# Altium schematic sheet FPGA_Power.SchDoc
size B; SheetNumber: 6; SheetTotal: 11
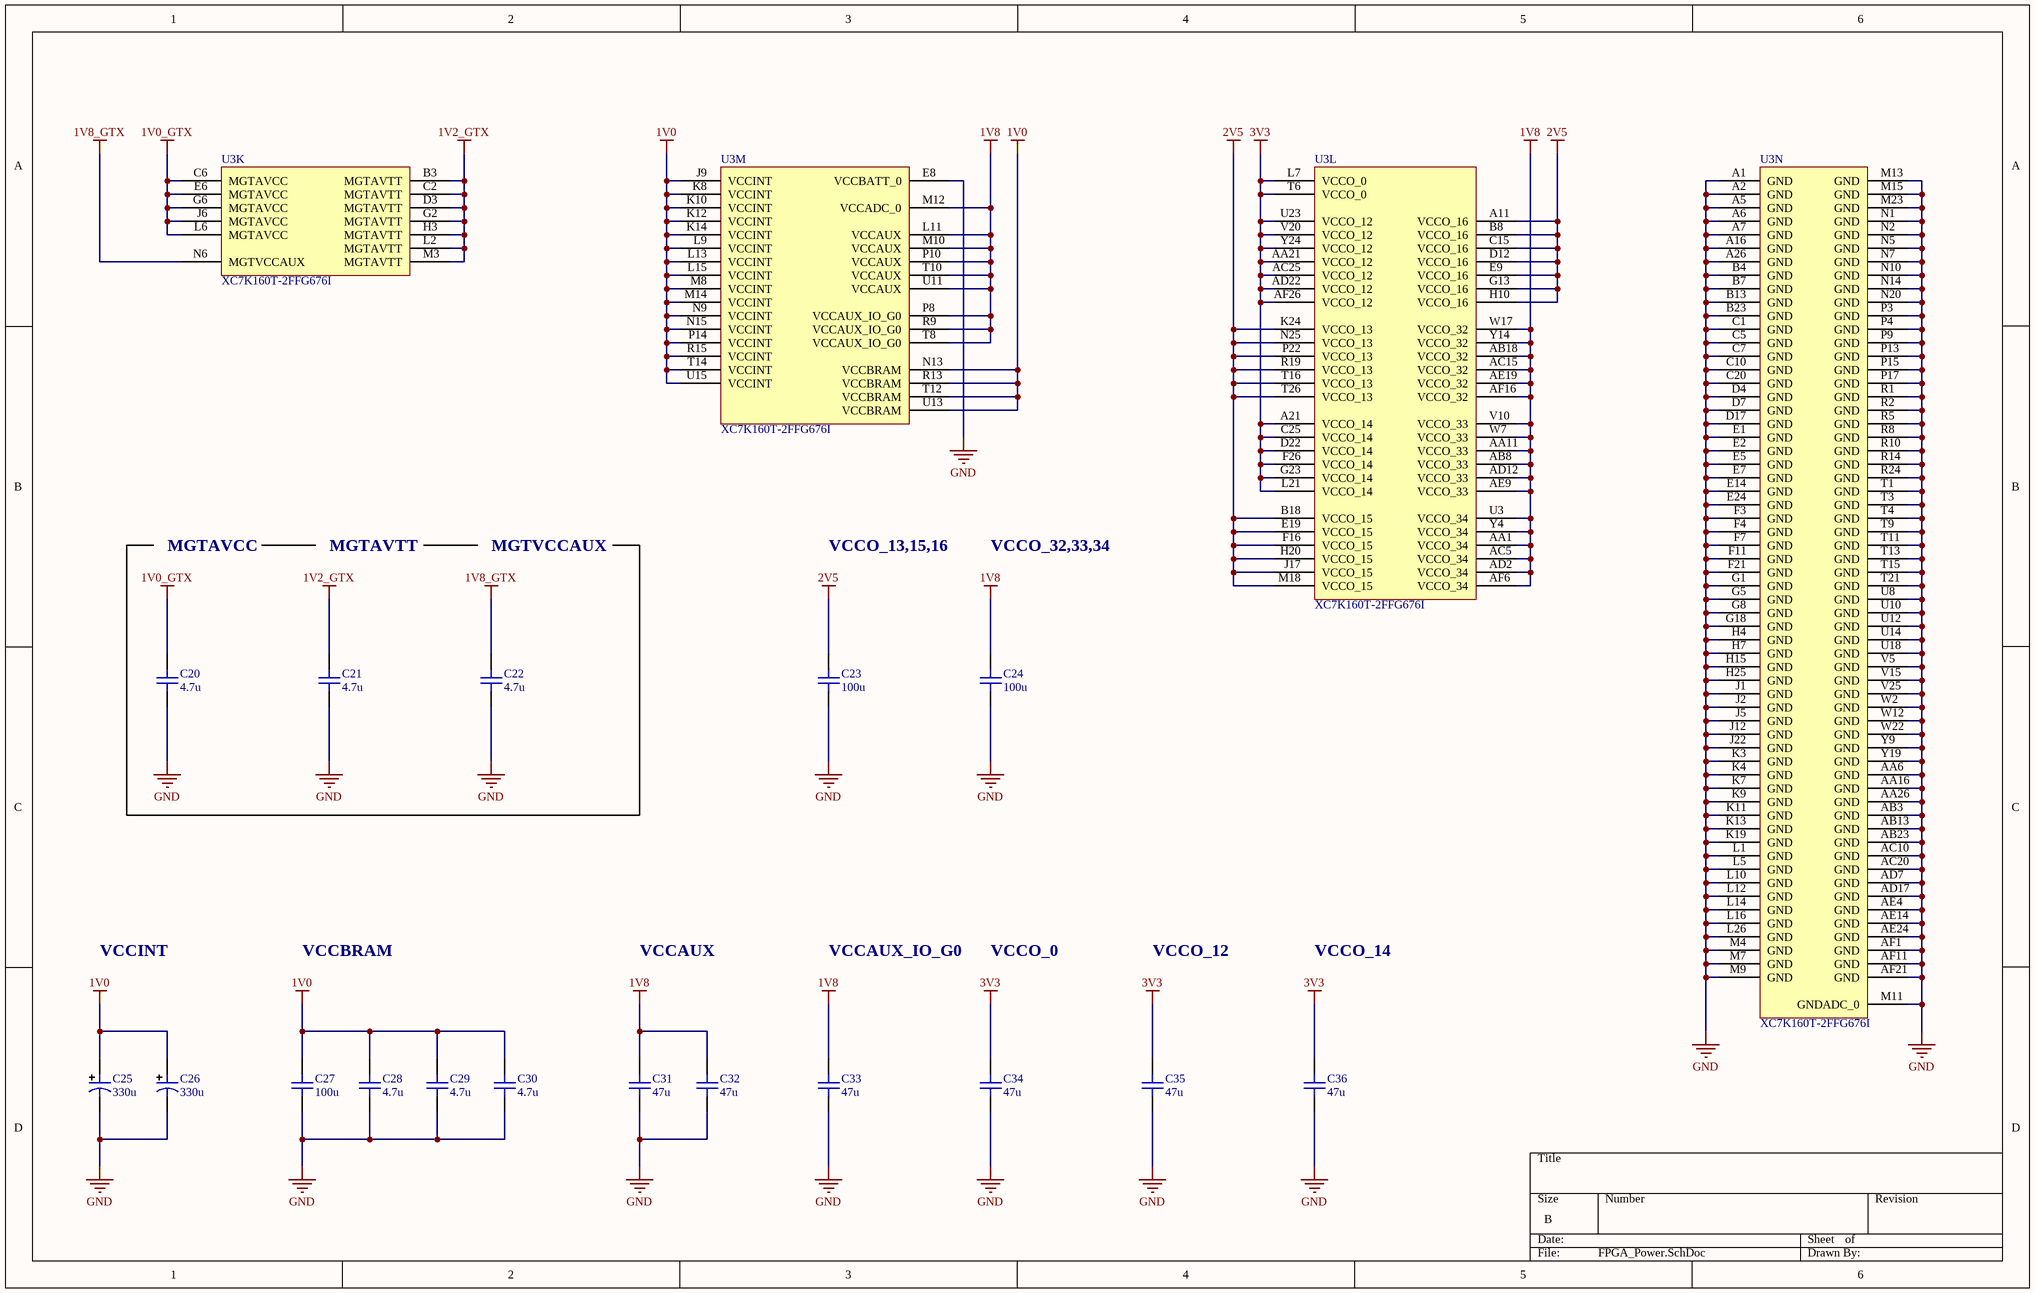
[diagram p0: FPGA_Power.SchDoc]

## Parts
C20  4.7u  [C_0402_Generic]
C21  4.7u  [C_0402_Generic]
C22  4.7u  [C_0402_Generic]
C23  100u  [C_0805_Generic]
C24  100u  [C_0805_Generic]
C25  330u  [C_TANT_EIA-3528-21_B]
C26  330u  [C_TANT_EIA-3528-21_B]
C27  100u  [C_0805_Generic]
C28  4.7u  [C_0402_Generic]
C29  4.7u  [C_0402_Generic]
C30  4.7u  [C_0402_Generic]
C31  47u  [C_0603_Generic]
C32  47u  [C_0603_Generic]
C33  47u  [C_0603_Generic]
C34  47u  [C_0603_Generic]
C35  47u  [C_0603_Generic]
C36  47u  [C_0603_Generic]
U3  XC7K160T-2FFG676I  [FFG676_(XC7K160T-2FFG676I)]  (parts K,L,M,N of 14)

## Nets
1V0: C25.1 C26.1 C27.2 C28.2 C29.2 C30.2 U3.J9(VCCINT) U3.K8(VCCINT) U3.K10(VCCINT) U3.K12(VCCINT) U3.K14(VCCINT) U3.L9(VCCINT) U3.L13(VCCINT) U3.L15(VCCINT) U3.M8(VCCINT) U3.M14(VCCINT) U3.N9(VCCINT) U3.N13(VCCBRAM) U3.N15(VCCINT) U3.P14(VCCINT) U3.R13(VCCBRAM) U3.R15(VCCINT) U3.T12(VCCBRAM) U3.T14(VCCINT) U3.U13(VCCBRAM) U3.U15(VCCINT)
1V0_GTX: C20.2 U3.C6(MGTAVCC) U3.E6(MGTAVCC) U3.G6(MGTAVCC) U3.J6(MGTAVCC) U3.L6(MGTAVCC)
1V2_GTX: C21.2 U3.B3(MGTAVTT) U3.C2(MGTAVTT) U3.D3(MGTAVTT) U3.G2(MGTAVTT) U3.H3(MGTAVTT) U3.L2(MGTAVTT) U3.M3(MGTAVTT)
1V8: C24.2 C31.2 C32.2 C33.2 U3.AA1(VCCO_34) U3.AA11(VCCO_33) U3.AB8(VCCO_33) U3.AB18(VCCO_32) U3.AC5(VCCO_34) U3.AC15(VCCO_32) U3.AD2(VCCO_34) U3.AD12(VCCO_33) U3.AE9(VCCO_33) U3.AE19(VCCO_32) U3.AF6(VCCO_34) U3.AF16(VCCO_32) U3.L11(VCCAUX) U3.M10(VCCAUX) U3.M12(VCCADC_0) U3.P8(VCCAUX_IO_G0) U3.P10(VCCAUX) U3.R9(VCCAUX_IO_G0) U3.T8(VCCAUX_IO_G0) U3.T10(VCCAUX) U3.U3(VCCO_34) U3.U11(VCCAUX) U3.V10(VCCO_33) U3.W7(VCCO_33) U3.W17(VCCO_32) U3.Y4(VCCO_34) U3.Y14(VCCO_32)
1V8_GTX: C22.2 U3.N6(MGTVCCAUX)
2V5: C23.2 U3.A11(VCCO_16) U3.B8(VCCO_16) U3.B18(VCCO_15) U3.C15(VCCO_16) U3.D12(VCCO_16) U3.E9(VCCO_16) U3.E19(VCCO_15) U3.F16(VCCO_15) U3.G13(VCCO_16) U3.H10(VCCO_16) U3.H20(VCCO_15) U3.J17(VCCO_15) U3.K24(VCCO_13) U3.M18(VCCO_15) U3.N25(VCCO_13) U3.P22(VCCO_13) U3.R19(VCCO_13) U3.T16(VCCO_13) U3.T26(VCCO_13)
3V3: C34.2 C35.2 C36.2 U3.A21(VCCO_14) U3.AA21(VCCO_12) U3.AC25(VCCO_12) U3.AD22(VCCO_12) U3.AF26(VCCO_12) U3.C25(VCCO_14) U3.D22(VCCO_14) U3.F26(VCCO_14) U3.G23(VCCO_14) U3.L7(VCCO_0) U3.L21(VCCO_14) U3.T6(VCCO_0) U3.U23(VCCO_12) U3.V20(VCCO_12) U3.Y24(VCCO_12)
GND: C20.1 C21.1 C22.1 C23.1 C24.1 C25.2 C26.2 C27.1 C28.1 C29.1 C30.1 C31.1 C32.1 C33.1 C34.1 C35.1 C36.1 U3.A1(GND) U3.A2(GND) U3.A5(GND) U3.A6(GND) U3.A7(GND) U3.A16(GND) U3.A26(GND) U3.AA6(GND) U3.AA16(GND) U3.AA26(GND) U3.AB3(GND) U3.AB13(GND) U3.AB23(GND) U3.AC10(GND) U3.AC20(GND) U3.AD7(GND) U3.AD17(GND) U3.AE4(GND) U3.AE14(GND) U3.AE24(GND) U3.AF1(GND) U3.AF11(GND) U3.AF21(GND) U3.B4(GND) U3.B7(GND) U3.B13(GND) U3.B23(GND) U3.C1(GND) U3.C5(GND) U3.C7(GND) U3.C10(GND) U3.C20(GND) U3.D4(GND) U3.D7(GND) U3.D17(GND) U3.E1(GND) U3.E2(GND) U3.E5(GND) U3.E7(GND) U3.E8(VCCBATT_0) U3.E14(GND) U3.E24(GND) U3.F3(GND) U3.F4(GND) U3.F7(GND) U3.F11(GND) U3.F21(GND) U3.G1(GND) U3.G5(GND) U3.G8(GND) U3.G18(GND) U3.H4(GND) U3.H7(GND) U3.H15(GND) U3.H25(GND) U3.J1(GND) U3.J2(GND) U3.J5(GND) U3.J12(GND) U3.J22(GND) U3.K3(GND) U3.K4(GND) U3.K7(GND) U3.K9(GND) U3.K11(GND) U3.K13(GND) U3.K19(GND) U3.L1(GND) U3.L5(GND) U3.L10(GND) U3.L12(GND) U3.L14(GND) U3.L16(GND) U3.L26(GND) U3.M4(GND) U3.M7(GND) U3.M9(GND) U3.M11(GNDADC_0) U3.M13(GND) U3.M15(GND) U3.M23(GND) U3.N1(GND) U3.N2(GND) U3.N5(GND) U3.N7(GND) U3.N10(GND) U3.N14(GND) U3.N20(GND) U3.P3(GND) U3.P4(GND) U3.P9(GND) U3.P13(GND) U3.P15(GND) U3.P17(GND) U3.R1(GND) U3.R2(GND) U3.R5(GND) U3.R8(GND) U3.R10(GND) U3.R14(GND) U3.R24(GND) U3.T1(GND) U3.T3(GND) U3.T4(GND) U3.T9(GND) U3.T11(GND) U3.T13(GND) U3.T15(GND) U3.T21(GND) U3.U8(GND) U3.U10(GND) U3.U12(GND) U3.U14(GND) U3.U18(GND) U3.V5(GND) U3.V15(GND) U3.V25(GND) U3.W2(GND) U3.W12(GND) U3.W22(GND) U3.Y9(GND) U3.Y19(GND)

## Notes on the sheet
- MGTAVCC
- MGTAVTT
- MGTVCCAUX
- VCCO_13,15,16
- VCCO_32,33,34
- VCCINT
- VCCBRAM
- VCCAUX
- VCCAUX_IO_G0
- VCCO_0
- VCCO_12
- VCCO_14

## Library data of the parts
C20-C22 C28-C30 = GRM155R61A475MEAAJ: 4.7µF 10V X5R SMD ceramic capacitor in 0402 size; Manufacturer: Murata Electronics; Manufacturer Part Number: GRM155R61A475MEAAJ
C23 C24 C27 = GRM21BR60J107ME15L: 100µF 6.3V X5R SMD ceramic capacitor in 0805 size; Manufacturer: Murata Electronics; Manufacturer Part Number: GRM21BR60J107ME15L
C25 C26 = T520B337M2R5ATE015: 330µF 2.5V 15mOhm SMD tantalum capacitor in EIA-3528-21size; Manufacturer: KEMET; Manufacturer Part Number: T520B337M2R5ATE015
C31-C36 = GRM188R60J476ME15D: 47µF 6.3V X5R SMD ceramic capacitor in 0603 size; Manufacturer: Murata Electronics; Manufacturer Part Number: GRM188R60J476ME15D
U3 = XC7K160T: Kintex-7 FPGA, 400 User I/Os, 8 GTX, 676-Ball BGA, Speed Grade 2, Industrial Grade, Pb-Free; Manufacturer: AMD/Xilinx; Manufacturer Part Number: XC7K160T-2FFG676I